# Altium schematic sheet sch_controller.SchDoc
size B; SheetNumber: 5; SheetTotal: 7
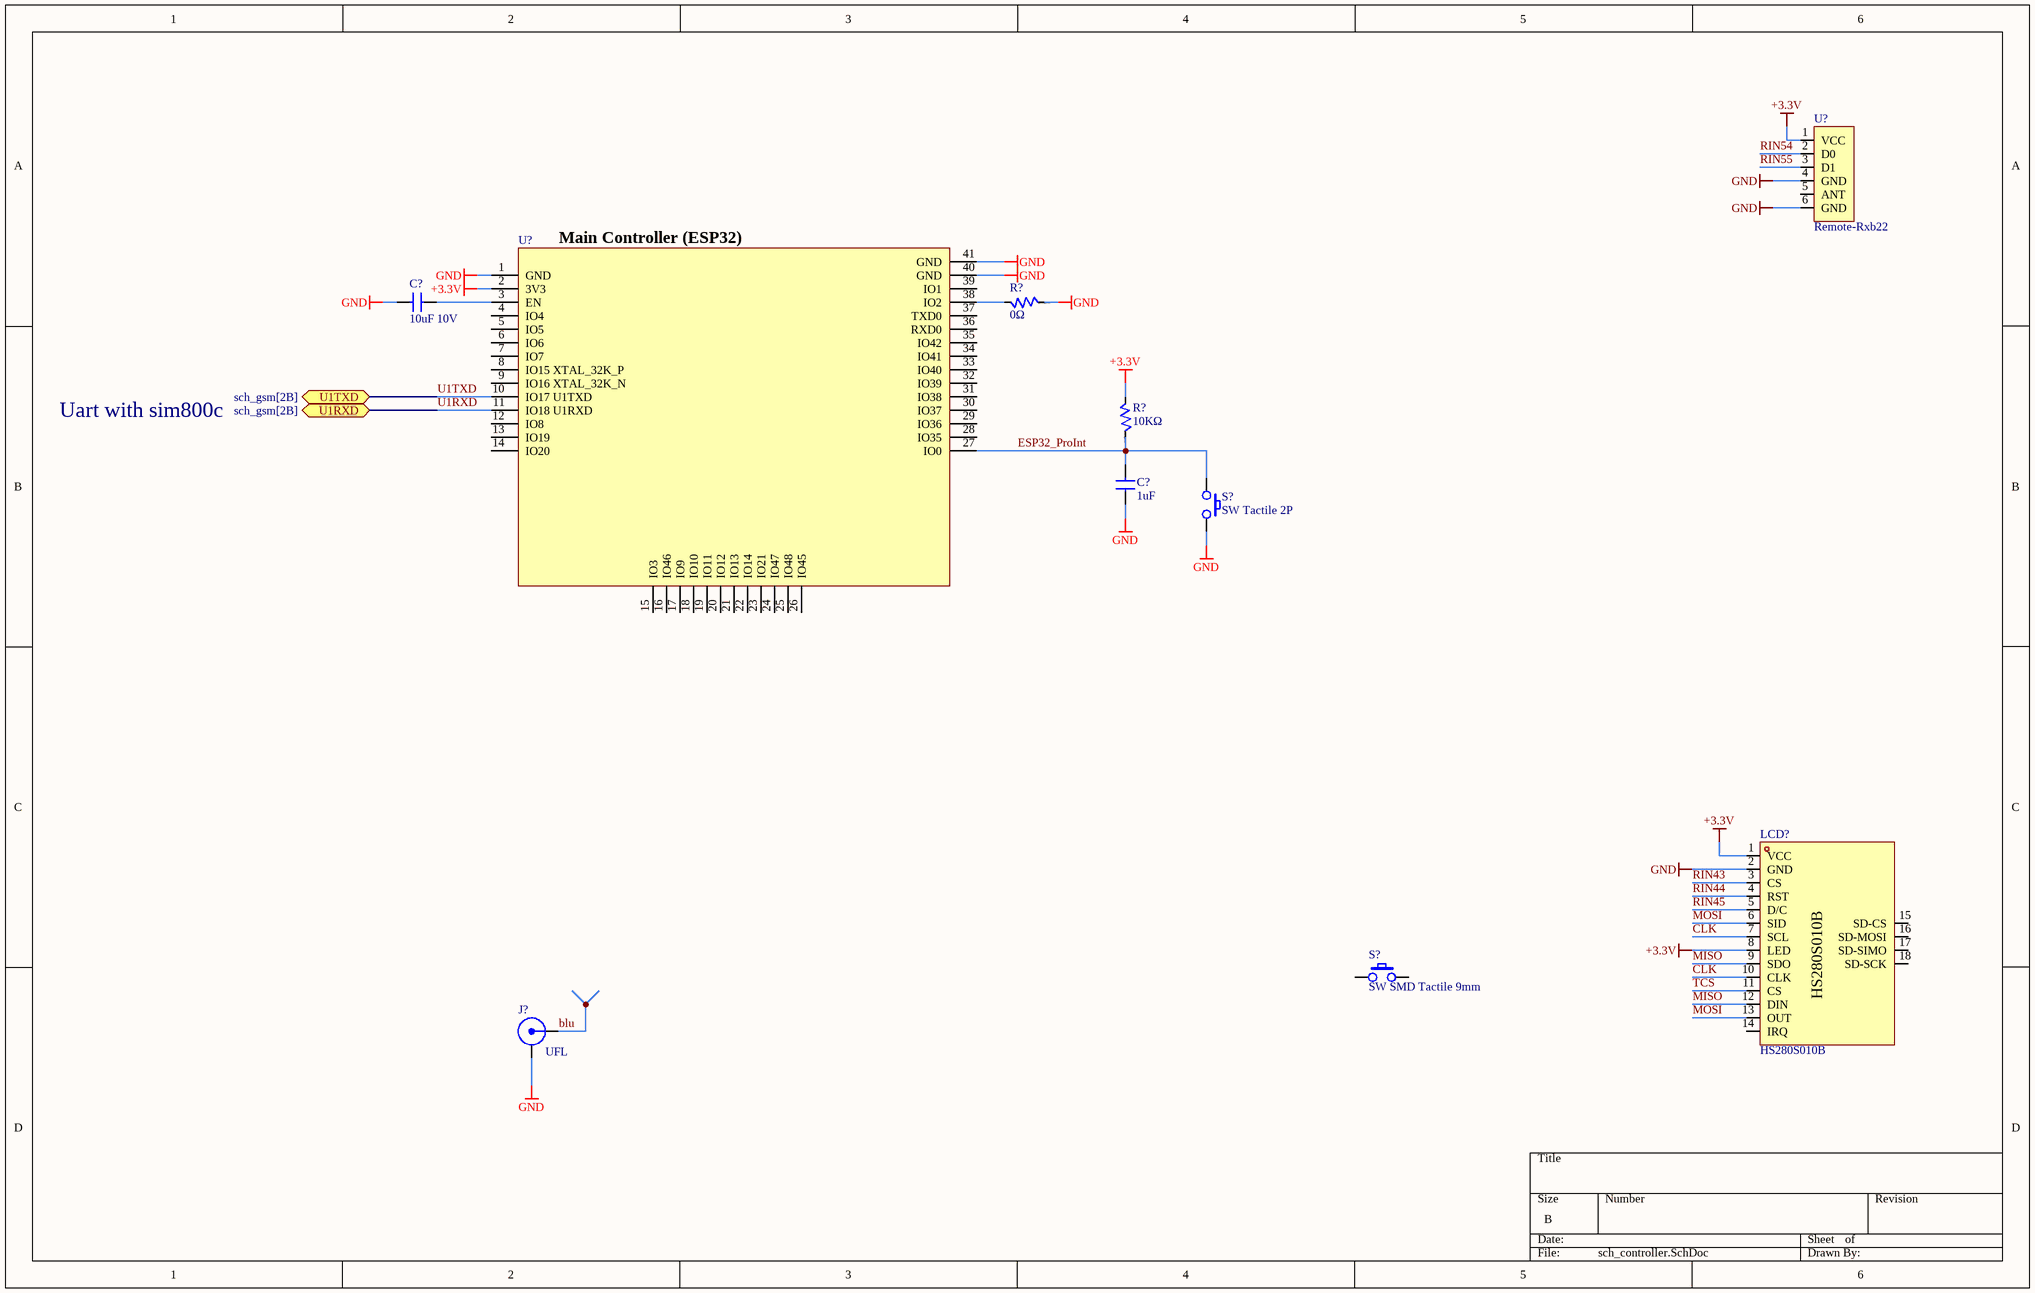
[diagram p0: sch_controller.SchDoc]

## Parts
(Parts that share a designator on the sheet are numbered #1, #2 ... from top to bottom, then left to right.)
C?#1  10uF 10V  [0603]
C?#2  1uF  [0402]
J?  UFL  [UFL]
LCD?  HS280S010B  [LCD-TH_HS280S010B]
R?#1  0Ω  [0603]
R?#2  10KΩ  [0402]
S?#1  SW Tactile 2P  [SW-SMD_L6.0-W3.3-LS8.0]
S?#2  SW SMD Tactile 9mm  [SW SMD_4P-L4.5-W4.5-P3.00-LS7.0]
U?#1  Remote-Rxb22  [remote-rxb22-433]
U?#2  (no value)  [WIRELM-SMD_ESP32-S3-WROOM-1U]

## Ports
U1RXD (bidir, see sch_gsm[2B]), U1TXD (bidir, see sch_gsm[2B])

## Nets
+3.3V: LCD?.1(VCC) LCD?.8(LED) R?#2.2 U?#1.1(VCC) U?#2.2(3V3)
GND: C?#1.2 C?#2.2 J?.2 LCD?.2(GND) R?#1.1 S?#1.1 U?#1.4(GND) U?#1.6(GND) U?#2.1(GND) U?#2.40(GND) U?#2.41(GND)
blu: J?.1
CLK: LCD?.7(SCL) LCD?.10(CLK)
ESP32_ProInt: C?#2.1 R?#2.1 S?#1.2 U?#2.27(IO0)
MISO: LCD?.9(SDO) LCD?.12(DIN)
MOSI: LCD?.6(SID) LCD?.13(OUT)
RIN43: LCD?.3(CS)
RIN44: LCD?.4(RST)
RIN45: LCD?.5(D/C)
RIN54: U?#1.2(D0)
RIN55: U?#1.3(D1)
TCS: LCD?.11(CS)
U1RXD: U?#2.11(IO18_U1RXD) ; port U1RXD
U1TXD: U?#2.10(IO17_U1TXD) ; port U1TXD
NetC?#1_1: C?#1.1 U?#2.3(EN)
NetR?#1_2: R?#1.2 U?#2.38(IO2)

Not connected (* = marked no-connect by the designer): LCD? 14(IRQ) 15(SD-CS) 16(SD-MOSI) 17(SD-SIMO) 18(SD-SCK); S?#2 1 2; U?#1 5(ANT); U?#2 4(IO4) 5(IO5) 6(IO6) 7(IO7) 8(IO15_XTAL_32K_P) 9(IO16_XTAL_32K_N) 12(IO8) 13(IO19) 14(IO20) 15(IO3) 16(IO46) 17(IO9) 18(IO10) 19(IO11) 20(IO12) 21(IO13) 22(IO14) 23(IO21) 24(IO47) 25(IO48) 26(IO45) 28(IO35) 29(IO36) 30(IO37) 31(IO38) 32(IO39) 33(IO40) 34(IO41) 35(IO42) 36(RXD0) 37(TXD0) 39(IO1)

## Notes on the sheet
- (near U?#2) Main Controller (ESP32)
- Uart with sim800c
- (in symbol R0R) @DesignPCB
- (in symbol R10K0402) @DesignPCB

## Library data of the parts
C?#1 = C10UF 10V: MFAC: CL10A106KP8NNNC; JLC: C19702
C?#2 = C1uF0402 25V: MFAC: CL05A105KA5NQNC; JLC: C52923
J? = BNC
LCD? = LCD-TH_HS280S010B: MFAC: HS280S010B; JLC: C2939938
R?#1 = R0R: MFAC: 0603WAF0000T5E; JLC: C21189
R?#2 = R10K0402: MFAC: RC0402FR-0710KL; JLC: C60490
S?#1 = SW Tactile Reset 2P: MFAC: TS-1101-C-W; JLC: C318938
S?#2 = SW Push 9mm: MFAC: TS-1109S-C-L; JLC: C840835
U?#2 = ESP32-S3-WROOM-1U-N16R8: MFAC: ESP32-S3-WROOM-1U-N16R8; JLC: C3013946